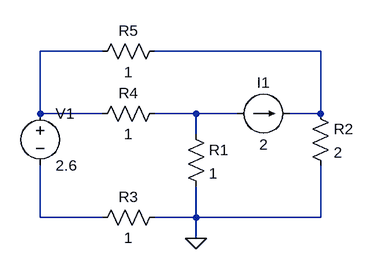
[diagram p0: schematic Q6.asc]
Q6.asc, the LTspice schematic file:
Version 4
SHEET 1 880 680
WIRE 16 0 -80 0
WIRE 352 0 96 0
WIRE -80 96 -80 0
WIRE 16 96 -80 96
WIRE 160 96 96 96
WIRE 224 96 160 96
WIRE 352 96 352 0
WIRE 352 96 304 96
WIRE 160 128 160 96
WIRE -80 256 -80 176
WIRE 16 256 -80 256
WIRE 160 256 160 208
WIRE 160 256 96 256
WIRE 352 256 352 176
WIRE 352 256 160 256
WIRE 160 288 160 256
FLAG 160 288 0
SYMBOL res 144 112 R0
SYMATTR InstName R1
SYMATTR Value 1
SYMBOL res 336 80 R0
SYMATTR InstName R2
SYMATTR Value 2
SYMBOL res 112 240 R90
WINDOW 0 0 56 VBottom 2
WINDOW 3 32 56 VTop 2
SYMATTR InstName R3
SYMATTR Value 1
SYMBOL res 112 80 R90
WINDOW 0 0 56 VBottom 2
WINDOW 3 32 56 VTop 2
SYMATTR InstName R4
SYMATTR Value 1
SYMBOL res 112 -16 R90
WINDOW 0 0 56 VBottom 2
WINDOW 3 32 56 VTop 2
SYMATTR InstName R5
SYMATTR Value 1
SYMBOL voltage -80 80 R0
WINDOW 123 0 0 Left 0
WINDOW 39 0 0 Left 0
SYMATTR InstName V1
SYMATTR Value 2.6
SYMBOL current 224 96 R270
WINDOW 0 32 40 VTop 2
WINDOW 3 -32 40 VBottom 2
WINDOW 123 0 0 Left 0
WINDOW 39 0 0 Left 0
SYMATTR InstName I1
SYMATTR Value 2

The netlist it stands for:
* Q6.asc
R1 N003 0 1
R2 N002 0 2
R3 0 N004 1
R4 N003 N001 1
R5 N002 N001 1
V1 N001 N004 2.6
I1 N003 N002 2
.backanno
.end